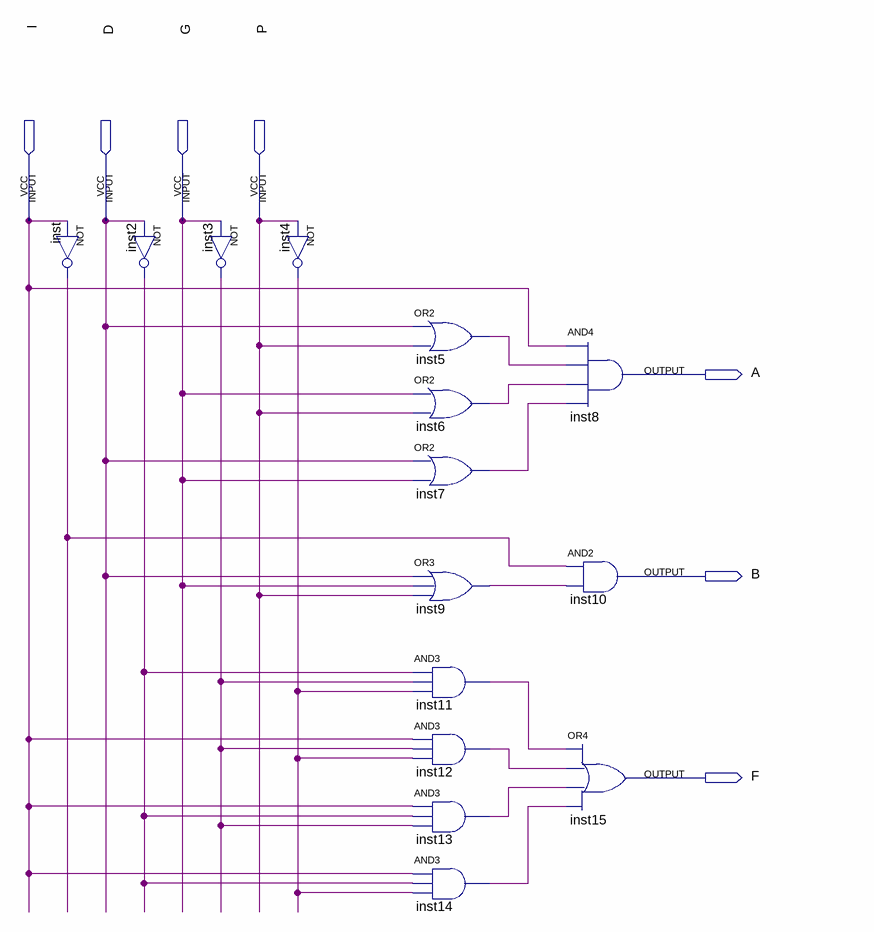
[diagram p0: schematic sheet]
// Quartus schematic step_2.bdf as structural Verilog: 15 symbols, 7 pins
module step_2 (
  input  I,
  input  D,
  input  G,
  input  P,
  output A,
  output B,
  output F
);

  wire inst2_out, inst3_out, inst4_out, inst5_out, inst6_out, inst7_out, inst9_out, inst11_out, inst12_out,
       inst13_out, inst14_out, inst_out;

  not inst (inst_out, I);
  not inst2 (inst2_out, D);
  not inst3 (inst3_out, G);
  not inst4 (inst4_out, P);
  or inst5 (inst5_out, D, P);
  or inst6 (inst6_out, G, P);
  or inst7 (inst7_out, D, G);
  or inst9 (inst9_out, D, G, P);
  and inst11 (inst11_out, inst2_out, inst3_out, inst4_out);
  and inst12 (inst12_out, I, inst3_out, inst4_out);
  and inst13 (inst13_out, I, inst2_out, inst3_out);
  and inst14 (inst14_out, I, inst2_out, inst4_out);
  and inst8 (A, I, inst5_out, inst6_out, inst7_out);
  and inst10 (B, inst_out, inst9_out);
  or inst15 (F, inst11_out, inst12_out, inst13_out, inst14_out);
endmodule
